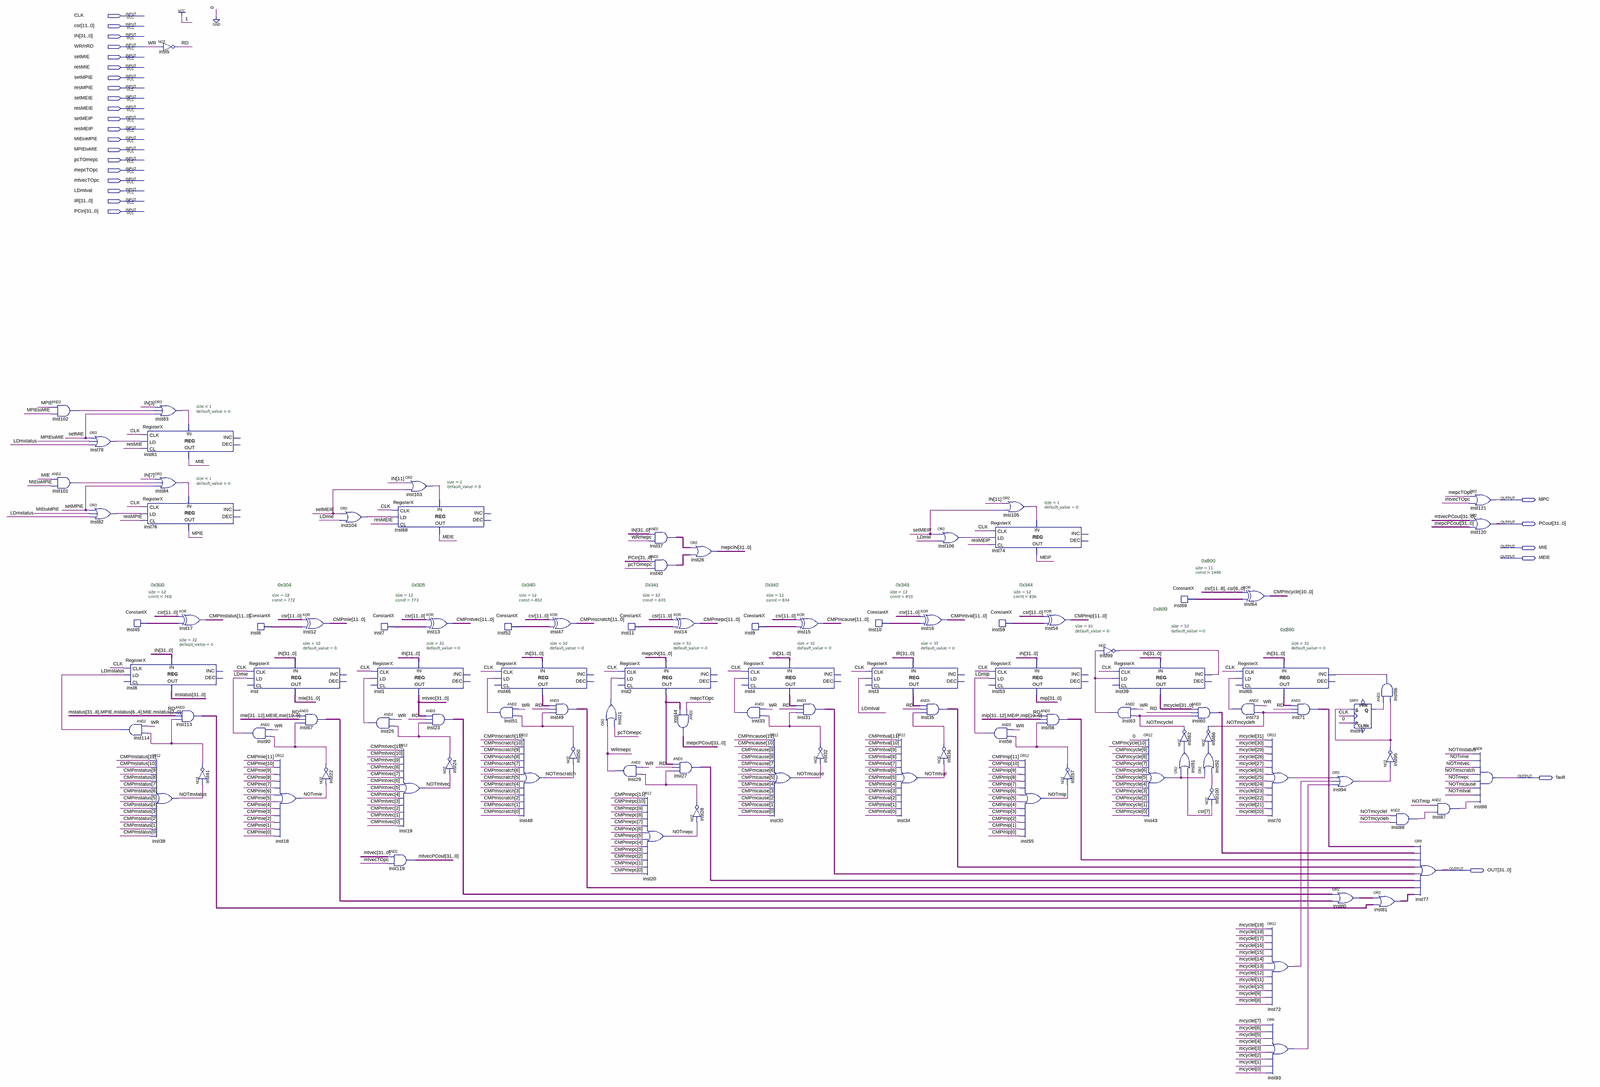
[diagram p0: schematic sheet, whole]
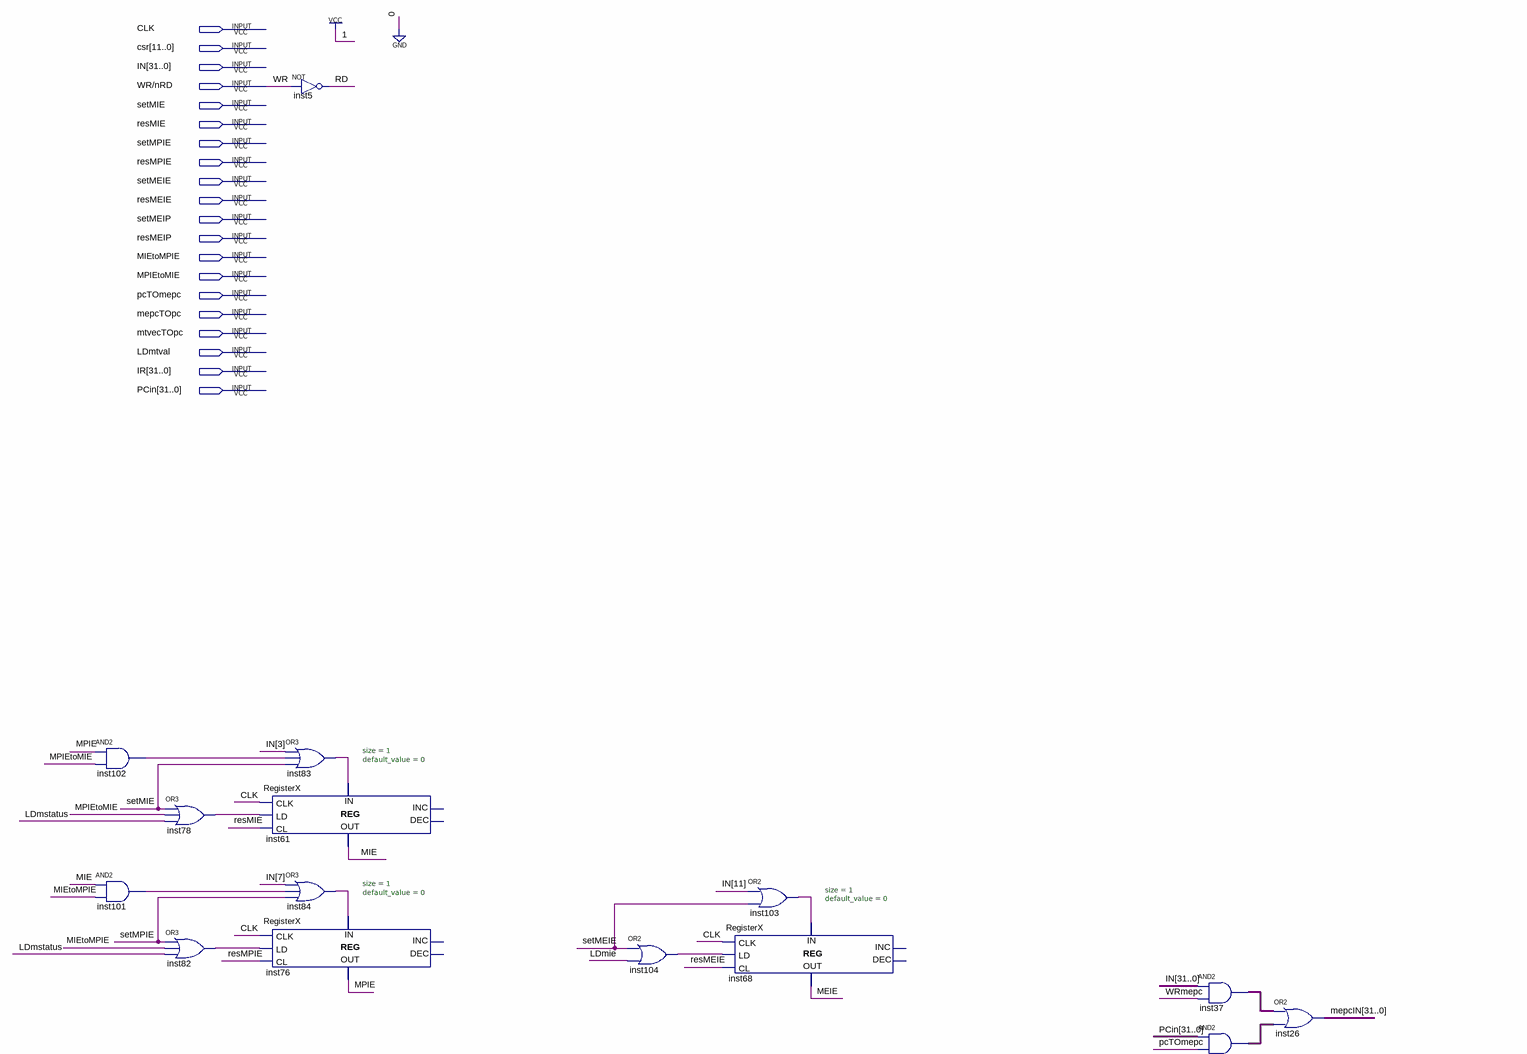
[diagram p1: schematic sheet, upper left part]
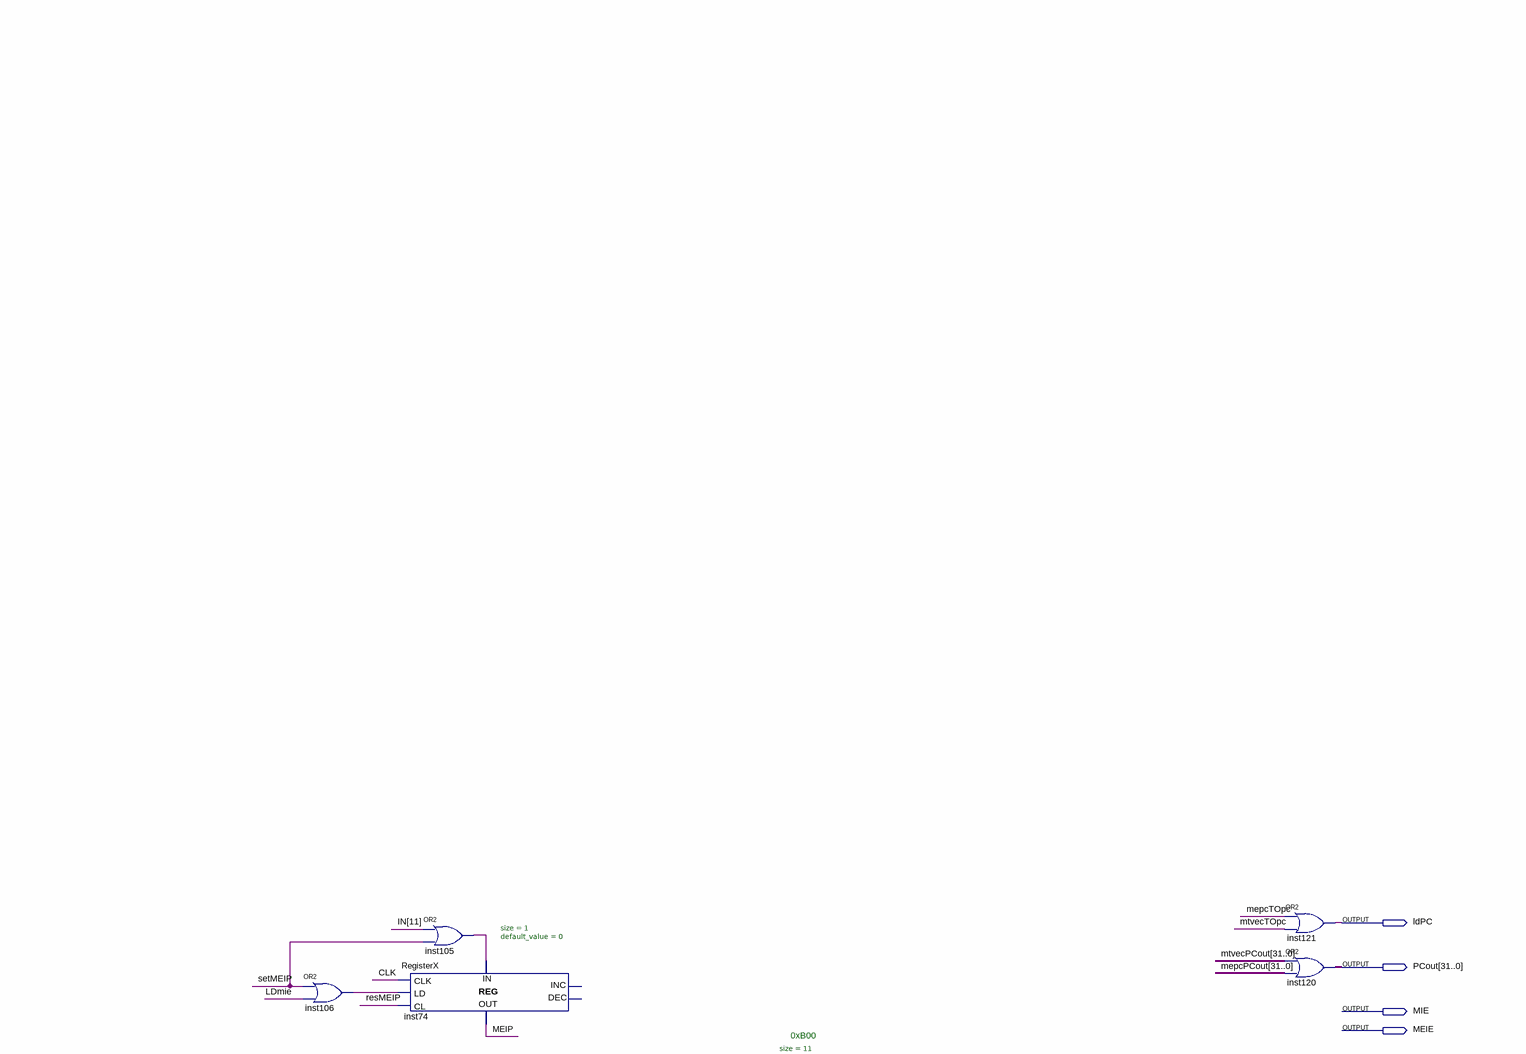
[diagram p2: schematic sheet, upper right part]
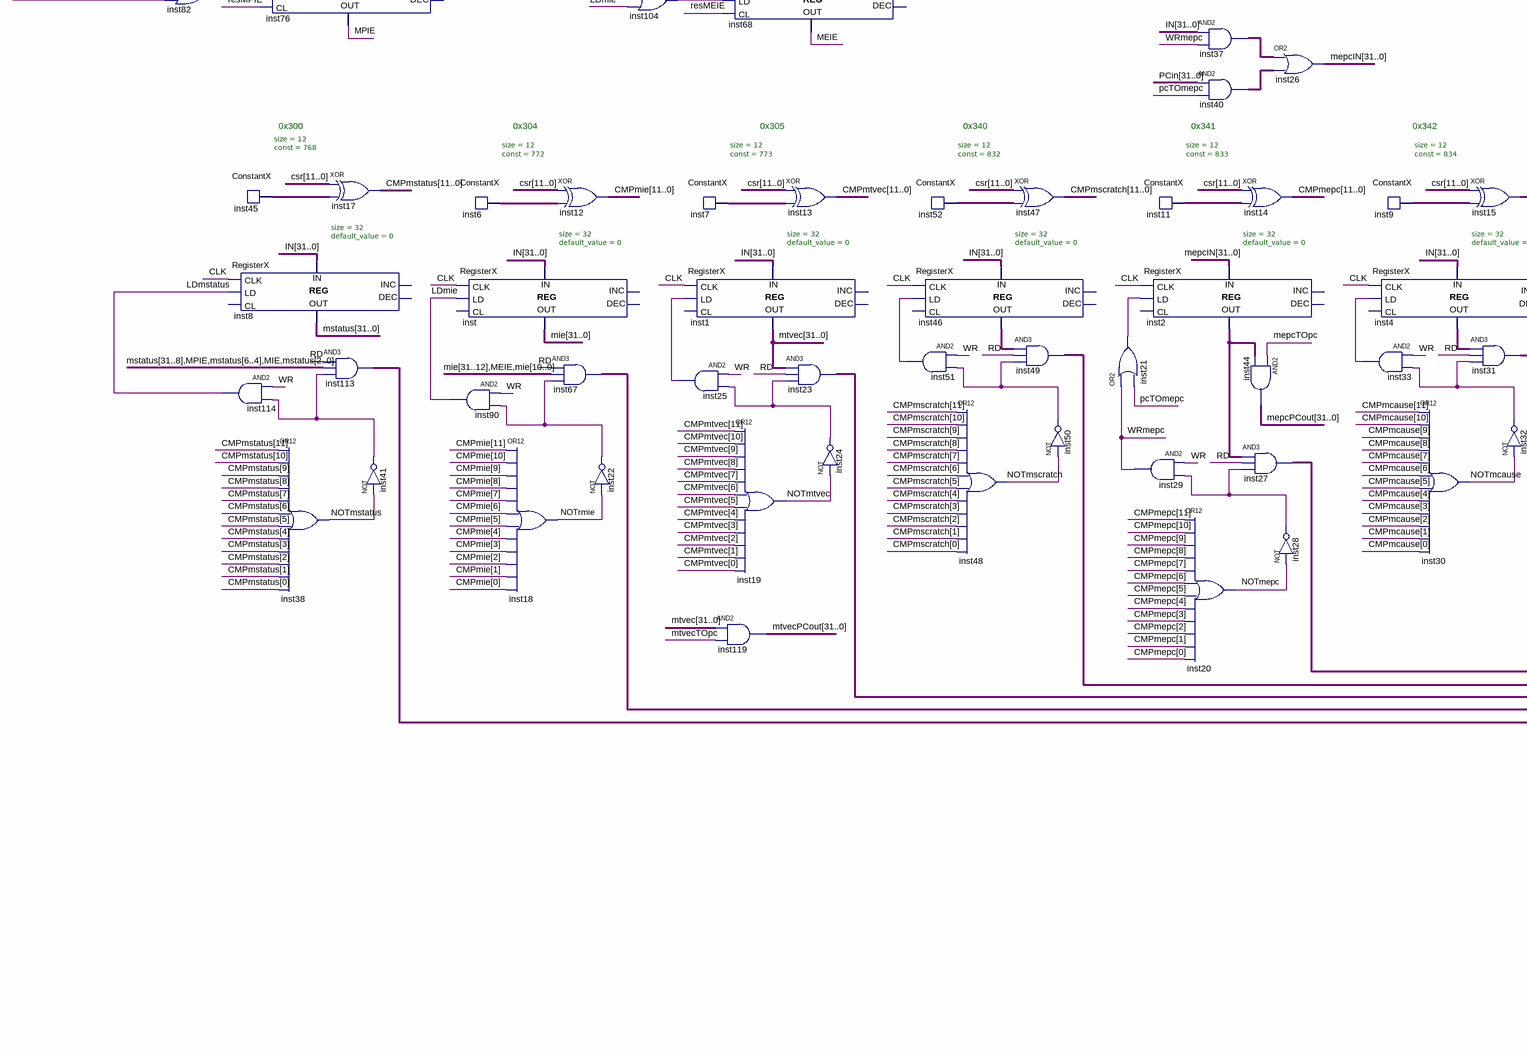
[diagram p3: schematic sheet, lower left part]
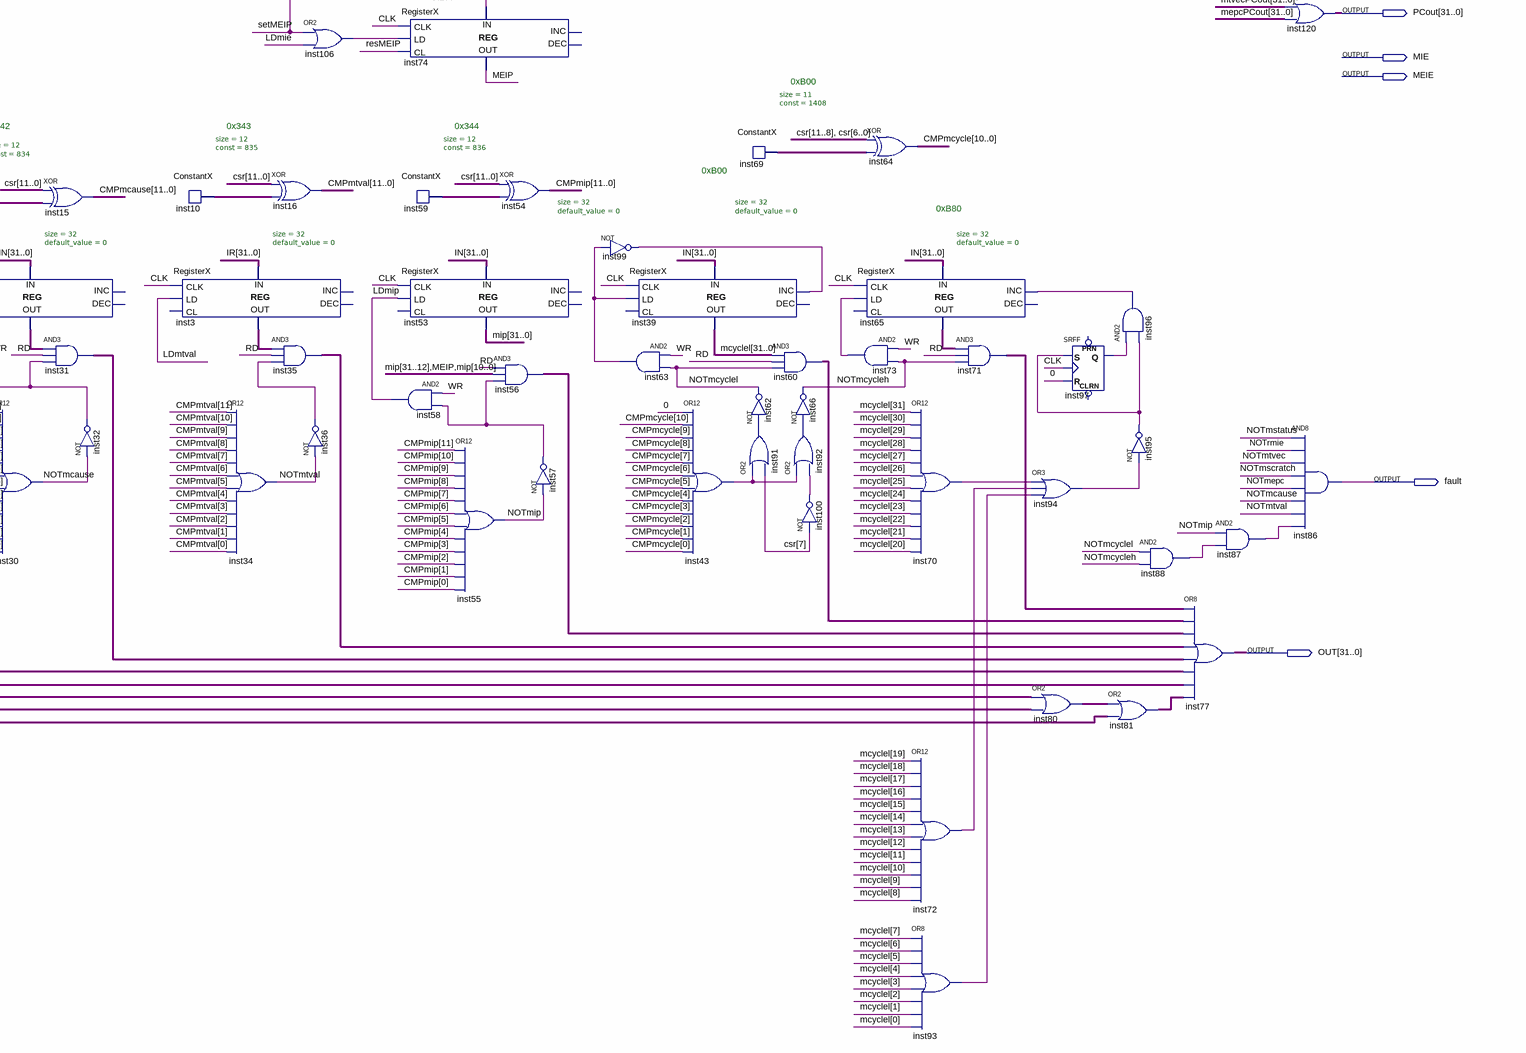
[diagram p4: schematic sheet, lower right part]
// Quartus schematic CSRegFile.bdf as structural Verilog: 106 symbols, 26 pins
module CSRegFile (
  input  CLK,
  input  [11:0] csr,
  input  [31:0] IN,
  input  \WR/nRD ,
  input  setMIE,
  input  resMIE,
  input  setMPIE,
  input  resMPIE,
  input  setMEIE,
  input  resMEIE,
  input  setMEIP,
  input  resMEIP,
  input  MIEtoMPIE,
  input  MPIEtoMIE,
  input  pcTOmepc,
  input  mepcTOpc,
  input  mtvecTOpc,
  input  LDmtval,
  input  [31:0] IR,
  input  [31:0] PCin,
  output ldPC,
  output [31:0] PCout,
  output MIE,
  output MEIE,
  output fault,
  output [31:0] OUT
);

  wire inst21_out, inst22_out, inst24_out, inst25_out, inst28_out, inst32_out, inst33_out, inst36_out,
       inst41_out, inst43_out, inst50_out, inst51_out, inst57_out, inst63_out, inst70_out, inst72_out,
       inst73_out, inst78_out, inst82_out, inst83_out, inst84_out, inst87_out, inst88_out, inst91_out,
       inst92_out, inst93_out, inst94_out, inst95_out, inst96_out, inst97_q, inst99_out, inst100_out,
       inst101_out, inst102_out, inst103_out, inst104_out, inst105_out, inst106_out, LDmie, LDmip, LDmstatus,
       MEIP, MPIE, NOTmcause, NOTmcycleh, NOTmcyclel, NOTmepc, NOTmip, NOTmscratch, NOTmstatus, NOTmtval,
       NOTmtvec, NOTrmie, RD, WRmepc;
  wire [10:0] CMPmcycle, inst69_data_out;
  wire [11:0] CMPmcause, CMPmepc, CMPmie, CMPmip, CMPmscratch, CMPmstatus, CMPmtval, CMPmtvec,
       inst6_data_out, inst7_data_out, inst9_data_out, inst10_data_out, inst11_data_out, inst45_data_out,
       inst52_data_out, inst59_data_out;
  wire [31:0] inst2_data_out, inst3_data_out, inst4_data_out, inst23_out, inst27_out, inst31_out, inst35_out,
       inst37_out, inst40_out, inst46_data_out, inst49_out, inst56_out, inst60_out, inst65_data_out,
       inst67_out, inst71_out, inst80_out, inst81_out, inst113_out, mcyclel, mepcIN, mepcPCout, MIE_bus, mip,
       mstatus, mtvec, mtvecPCout;

  and inst102 (inst102_out, MPIE, MPIEtoMIE);
  and inst101 (inst101_out, MIE, MIEtoMPIE);
  or inst78 (inst78_out, setMIE, MPIEtoMIE, LDmstatus);
  or inst82 (inst82_out, setMPIE, MIEtoMPIE, LDmstatus);
  RegisterX #(.size(1), .default_value(0)) inst61 (
    .CLK(CLK), .LD(inst78_out), .CL(resMIE), .DATA_IN(inst83_out), .DATA_OUT(MIE));  // open: INC, DEC
  RegisterX #(.size(1), .default_value(0)) inst76 (
    .CLK(CLK), .LD(inst82_out), .CL(resMPIE), .DATA_IN(inst84_out), .DATA_OUT(MPIE));  // open: INC, DEC
  ConstantX #(.size(12), .\const (768)) inst45 (.DATA_OUT(inst45_data_out));
  RegisterX #(.size(32), .default_value(0)) inst8 (
    .CLK(CLK), .LD(LDmstatus), .DATA_IN(IN), .DATA_OUT(mstatus));  // open: CL, INC, DEC
  and inst114 (LDmstatus, \WR/nRD , inst41_out);
  not inst5 (RD, \WR/nRD );
  or inst83 (inst83_out, IN[3], inst102_out, setMIE);
  or inst84 (inst84_out, IN[7], inst101_out, setMPIE);
  or inst38 (NOTmstatus, CMPmstatus[11], CMPmstatus[10], CMPmstatus[9], CMPmstatus[8], CMPmstatus[7], CMPmstatus[6], CMPmstatus[5], CMPmstatus[4], CMPmstatus[3], CMPmstatus[2], CMPmstatus[1], CMPmstatus[0]);
  assign CMPmstatus = csr ^ inst45_data_out;  // XOR inst17, 12 bits wide
  assign inst113_out = {32{RD}} & {mstatus[31:8], MPIE, mstatus[6:4], MIE, mstatus[2:0]} & {32{inst41_out}};  // AND3 inst113, 32 bits wide
  not inst41 (inst41_out, NOTmstatus);
  ConstantX #(.size(12), .\const (772)) inst6 (.DATA_OUT(inst6_data_out));
  RegisterX #(.size(32), .default_value(0)) inst (
    .CLK(CLK), .LD(LDmie), .DATA_IN(IN), .DATA_OUT(MIE_bus));  // open: CL, INC, DEC
  and inst90 (LDmie, \WR/nRD , inst22_out);
  or inst18 (NOTrmie, CMPmie[11], CMPmie[10], CMPmie[9], CMPmie[8], CMPmie[7], CMPmie[6], CMPmie[5], CMPmie[4], CMPmie[3], CMPmie[2], CMPmie[1], CMPmie[0]);
  assign CMPmie = csr ^ inst6_data_out;  // XOR inst12, 12 bits wide
  assign inst67_out = {32{RD}} & {MIE_bus[31:12], MEIE, MIE_bus[10:0]} & {32{inst22_out}};  // AND3 inst67, 32 bits wide
  not inst22 (inst22_out, NOTrmie);
  or inst104 (inst104_out, setMEIE, LDmie);
  ConstantX #(.size(12), .\const (773)) inst7 (.DATA_OUT(inst7_data_out));
  RegisterX #(.size(32), .default_value(0)) inst1 (
    .CLK(CLK), .LD(inst25_out), .DATA_IN(IN), .DATA_OUT(mtvec));  // open: CL, INC, DEC
  and inst25 (inst25_out, \WR/nRD , inst24_out);
  assign mtvecPCout = mtvec & {32{mtvecTOpc}};  // AND2 inst119, 32 bits wide
  or inst103 (inst103_out, IN[11], setMEIE);
  RegisterX #(.size(1), .default_value(0)) inst68 (
    .CLK(CLK), .LD(inst104_out), .CL(resMEIE), .DATA_IN(inst103_out), .DATA_OUT(MEIE));  // open: INC, DEC
  or inst19 (NOTmtvec, CMPmtvec[11], CMPmtvec[10], CMPmtvec[9], CMPmtvec[8], CMPmtvec[7], CMPmtvec[6], CMPmtvec[5], CMPmtvec[4], CMPmtvec[3], CMPmtvec[2], CMPmtvec[1], CMPmtvec[0]);
  assign CMPmtvec = csr ^ inst7_data_out;  // XOR inst13, 12 bits wide
  assign inst23_out = mtvec & {32{RD}} & {32{inst24_out}};  // AND3 inst23, 32 bits wide
  not inst24 (inst24_out, NOTmtvec);
  ConstantX #(.size(12), .\const (832)) inst52 (.DATA_OUT(inst52_data_out));
  RegisterX #(.size(32), .default_value(0)) inst46 (
    .CLK(CLK), .LD(inst51_out), .DATA_IN(IN), .DATA_OUT(inst46_data_out));  // open: CL, INC, DEC
  and inst51 (inst51_out, \WR/nRD , inst50_out);
  or inst48 (NOTmscratch, CMPmscratch[11], CMPmscratch[10], CMPmscratch[9], CMPmscratch[8], CMPmscratch[7], CMPmscratch[6], CMPmscratch[5], CMPmscratch[4], CMPmscratch[3], CMPmscratch[2], CMPmscratch[1], CMPmscratch[0]);
  assign CMPmscratch = csr ^ inst52_data_out;  // XOR inst47, 12 bits wide
  assign inst49_out = inst46_data_out & {32{RD}} & {32{inst50_out}};  // AND3 inst49, 32 bits wide
  not inst50 (inst50_out, NOTmscratch);
  or inst21 (inst21_out, WRmepc, pcTOmepc);
  ConstantX #(.size(12), .\const (833)) inst11 (.DATA_OUT(inst11_data_out));
  RegisterX #(.size(32), .default_value(0)) inst2 (
    .CLK(CLK), .LD(inst21_out), .DATA_IN(mepcIN), .DATA_OUT(inst2_data_out));  // open: CL, INC, DEC
  and inst29 (WRmepc, \WR/nRD , inst28_out);
  assign inst37_out = IN & {32{WRmepc}};  // AND2 inst37, 32 bits wide
  assign inst40_out = PCin & {32{pcTOmepc}};  // AND2 inst40, 32 bits wide
  or inst20 (NOTmepc, CMPmepc[11], CMPmepc[10], CMPmepc[9], CMPmepc[8], CMPmepc[7], CMPmepc[6], CMPmepc[5], CMPmepc[4], CMPmepc[3], CMPmepc[2], CMPmepc[1], CMPmepc[0]);
  assign mepcIN = inst37_out | inst40_out;  // OR2 inst26, 32 bits wide
  assign CMPmepc = csr ^ inst11_data_out;  // XOR inst14, 12 bits wide
  assign mepcPCout = {32{mepcTOpc}} & inst2_data_out;  // AND2 inst44, 32 bits wide
  assign inst27_out = inst2_data_out & {32{RD}} & {32{inst28_out}};  // AND3 inst27, 32 bits wide
  not inst28 (inst28_out, NOTmepc);
  ConstantX #(.size(12), .\const (834)) inst9 (.DATA_OUT(inst9_data_out));
  RegisterX #(.size(32), .default_value(0)) inst4 (
    .CLK(CLK), .LD(inst33_out), .DATA_IN(IN), .DATA_OUT(inst4_data_out));  // open: CL, INC, DEC
  and inst33 (inst33_out, \WR/nRD , inst32_out);
  or inst30 (NOTmcause, CMPmcause[11], CMPmcause[10], CMPmcause[9], CMPmcause[8], CMPmcause[7], CMPmcause[6], CMPmcause[5], CMPmcause[4], CMPmcause[3], CMPmcause[2], CMPmcause[1], CMPmcause[0]);
  assign CMPmcause = csr ^ inst9_data_out;  // XOR inst15, 12 bits wide
  assign inst31_out = inst4_data_out & {32{RD}} & {32{inst32_out}};  // AND3 inst31, 32 bits wide
  not inst32 (inst32_out, NOTmcause);
  ConstantX #(.size(12), .\const (835)) inst10 (.DATA_OUT(inst10_data_out));
  RegisterX #(.size(32), .default_value(0)) inst3 (
    .CLK(CLK), .LD(LDmtval), .DATA_IN(IR), .DATA_OUT(inst3_data_out));  // open: CL, INC, DEC
  or inst34 (NOTmtval, CMPmtval[11], CMPmtval[10], CMPmtval[9], CMPmtval[8], CMPmtval[7], CMPmtval[6], CMPmtval[5], CMPmtval[4], CMPmtval[3], CMPmtval[2], CMPmtval[1], CMPmtval[0]);
  or inst106 (inst106_out, setMEIP, LDmie);
  assign CMPmtval = csr ^ inst10_data_out;  // XOR inst16, 12 bits wide
  assign inst35_out = inst3_data_out & {32{RD}} & {32{inst36_out}};  // AND3 inst35, 32 bits wide
  not inst36 (inst36_out, NOTmtval);
  RegisterX #(.size(1), .default_value(0)) inst74 (
    .CLK(CLK), .LD(inst106_out), .CL(resMEIP), .DATA_IN(inst105_out), .DATA_OUT(MEIP));  // open: INC, DEC
  ConstantX #(.size(12), .\const (836)) inst59 (.DATA_OUT(inst59_data_out));
  RegisterX #(.size(32), .default_value(0)) inst53 (
    .CLK(CLK), .LD(LDmip), .DATA_IN(IN), .DATA_OUT(mip));  // open: CL, INC, DEC
  and inst58 (LDmip, \WR/nRD , inst57_out);
  or inst105 (inst105_out, IN[11], setMEIP);
  or inst55 (NOTmip, CMPmip[11], CMPmip[10], CMPmip[9], CMPmip[8], CMPmip[7], CMPmip[6], CMPmip[5], CMPmip[4], CMPmip[3], CMPmip[2], CMPmip[1], CMPmip[0]);
  assign CMPmip = csr ^ inst59_data_out;  // XOR inst54, 12 bits wide
  assign inst56_out = {32{RD}} & {mip[31:12], MEIP, mip[10:0]} & {32{inst57_out}};  // AND3 inst56, 32 bits wide
  not inst57 (inst57_out, NOTmip);
  not inst99 (inst99_out, inst63_out);
  RegisterX #(.size(32), .default_value(0)) inst39 (
    .CLK(CLK), .LD(inst63_out), .INC(inst99_out), .DATA_IN(IN), .DATA_OUT(mcyclel));  // open: CL, DEC
  and inst63 (inst63_out, \WR/nRD , NOTmcyclel);
  or inst43 (inst43_out, 1'b0, CMPmcycle[10], CMPmcycle[9], CMPmcycle[8], CMPmcycle[7], CMPmcycle[6], CMPmcycle[5], CMPmcycle[4], CMPmcycle[3], CMPmcycle[2], CMPmcycle[1], CMPmcycle[0]);
  ConstantX #(.size(11), .\const (1408)) inst69 (.DATA_OUT(inst69_data_out));
  not inst62 (NOTmcyclel, inst91_out);
  or inst91 (inst91_out, inst43_out, csr[7]);
  assign inst60_out = mcyclel & {32{RD}} & {32{NOTmcyclel}};  // AND3 inst60, 32 bits wide
  not inst66 (NOTmcycleh, inst92_out);
  or inst92 (inst92_out, inst43_out, inst100_out);
  not inst100 (inst100_out, csr[7]);
  RegisterX #(.size(32), .default_value(0)) inst65 (
    .CLK(CLK), .LD(inst73_out), .INC(inst96_out), .DATA_IN(IN), .DATA_OUT(inst65_data_out));  // open: CL, DEC
  and inst73 (inst73_out, \WR/nRD , NOTmcycleh);
  assign CMPmcycle = {csr[11:8], csr[6:0]} ^ inst69_data_out;  // XOR inst64, 11 bits wide
  or inst70 (inst70_out, mcyclel[31], mcyclel[30], mcyclel[29], mcyclel[28], mcyclel[27], mcyclel[26], mcyclel[25], mcyclel[24], mcyclel[23], mcyclel[22], mcyclel[21], mcyclel[20]);
  or inst72 (inst72_out, mcyclel[19], mcyclel[18], mcyclel[17], mcyclel[16], mcyclel[15], mcyclel[14], mcyclel[13], mcyclel[12], mcyclel[11], mcyclel[10], mcyclel[9], mcyclel[8]);
  or inst93 (inst93_out, mcyclel[7], mcyclel[6], mcyclel[5], mcyclel[4], mcyclel[3], mcyclel[2], mcyclel[1], mcyclel[0]);
  assign inst71_out = inst65_data_out & {32{RD}} & {32{NOTmcycleh}};  // AND3 inst71, 32 bits wide
  SRFF inst97 (.S(inst95_out), .R(1'b0), .CLK(CLK), .Q(inst97_q));  // open: PRN, CLRN
  or inst94 (inst94_out, inst70_out, inst72_out, inst93_out);
  assign inst80_out = inst23_out | inst67_out;  // OR2 inst80, 32 bits wide
  and inst96 (inst96_out, inst97_q, inst95_out);
  assign inst81_out = inst80_out | inst113_out;  // OR2 inst81, 32 bits wide
  not inst95 (inst95_out, inst94_out);
  and inst88 (inst88_out, NOTmcyclel, NOTmcycleh);
  and inst87 (inst87_out, NOTmip, inst88_out);
  assign OUT = inst71_out | inst60_out | inst56_out | inst35_out | inst31_out | inst27_out | inst49_out | inst81_out;  // OR8 inst77, 32 bits wide
  or inst121 (ldPC, mepcTOpc, mtvecTOpc);
  assign PCout = mtvecPCout | mepcPCout;  // OR2 inst120, 32 bits wide
  and inst86 (fault, NOTmstatus, NOTrmie, NOTmtvec, NOTmscratch, NOTmepc, NOTmcause, NOTmtval, inst87_out);

  // Other names for the same wires on the sheet: WR = \WR/nRD 

  // Notes on the sheet:
  //   0xB00
  //   0x300
  //   0x304
  //   0x305
  //   0x340
  //   0x341
  //   0x342
  //   0x343
  //   0x344
  //   0xB00
  //   0xB80
endmodule
